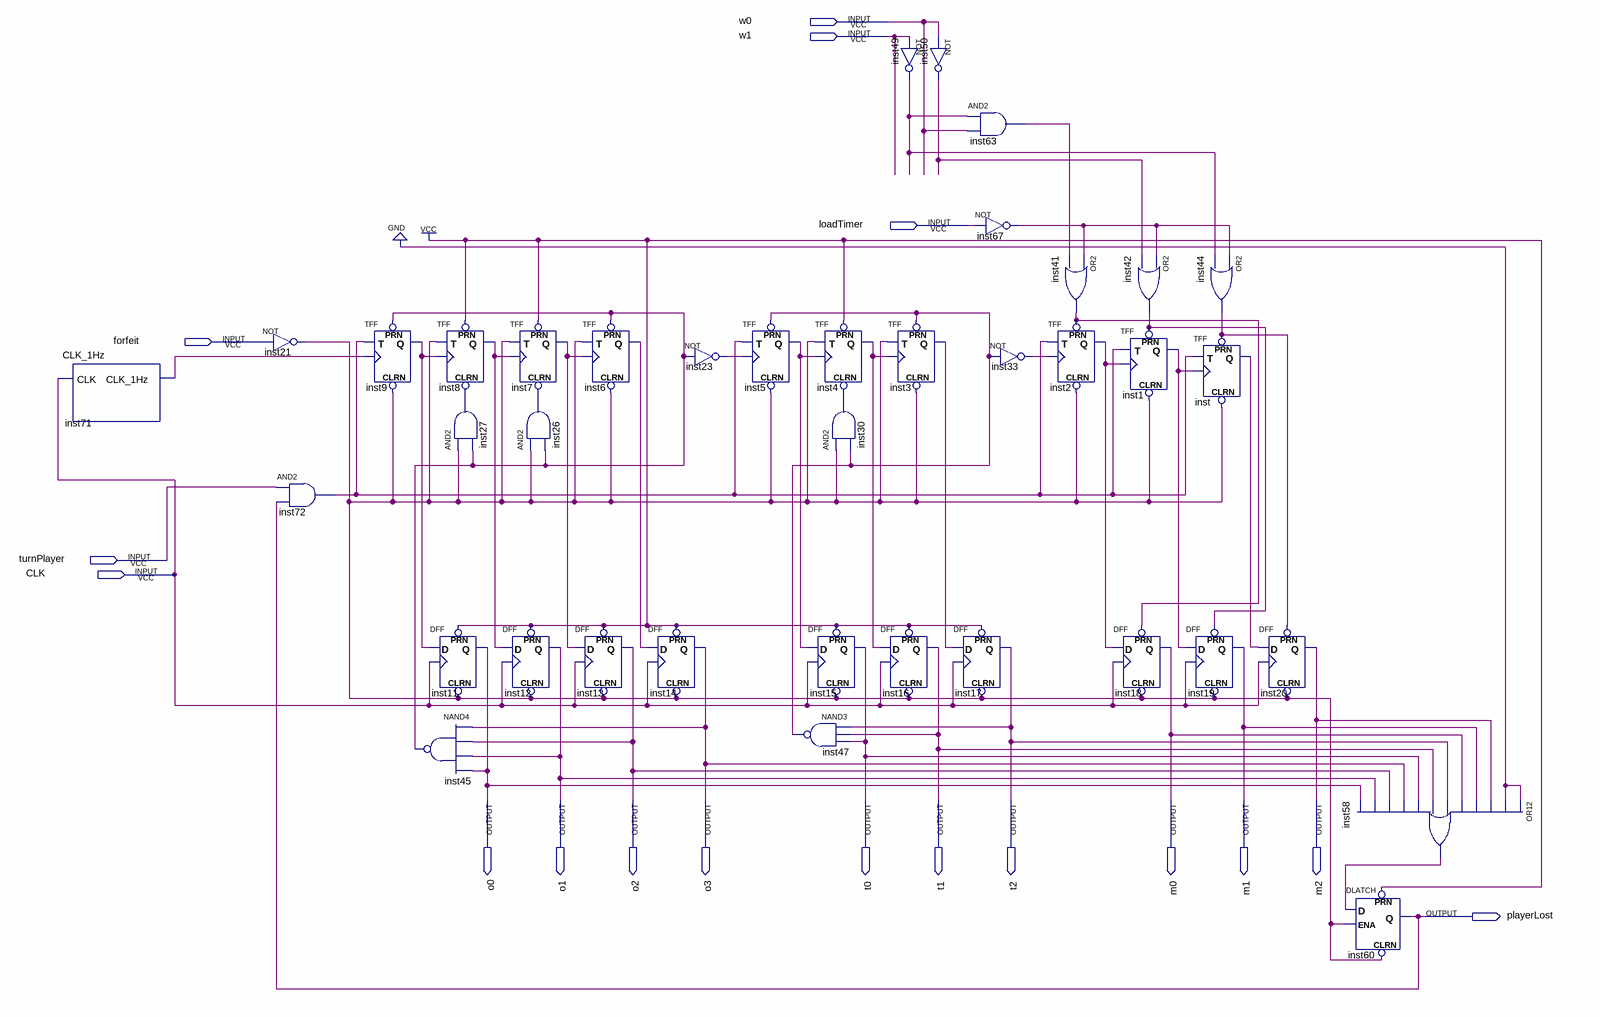
[diagram p0: schematic sheet]
// Quartus schematic player_register.bdf as structural Verilog: 39 symbols, 17 pins
module player_register (
  input  w0,
  input  w1,
  input  loadTimer,
  input  forfeit,
  input  turnPlayer,
  input  CLK,
  output o0,
  output o1,
  output o2,
  output o3,
  output t0,
  output t1,
  output t2,
  output m0,
  output m1,
  output m2,
  output playerLost
);

  wire inst1_q, inst2_q, inst3_q, inst4_q, inst5_q, inst6_q, inst7_q, inst8_q, inst9_q, inst21_out,
       inst23_out, inst26_out, inst27_out, inst30_out, inst33_out, inst41_out, inst42_out, inst44_out,
       inst45_out, inst47_out, inst49_out, inst50_out, inst58_out, inst63_out, inst67_out, inst71_clk_1hz,
       inst72_out, inst_q;

  CLK_1Hz inst71 (.CLK(CLK), .CLK_1Hz(inst71_clk_1hz));
  not inst21 (inst21_out, forfeit);
  and inst72 (inst72_out, turnPlayer, playerLost);
  TFF inst9 (.PRN(inst45_out), .CLRN(inst21_out), .T(inst72_out), .CLK(inst71_clk_1hz), .Q(inst9_q));
  nand inst45 (inst45_out, o3, o2, o1, o0);
  TFF inst8 (.PRN(1'b1), .CLRN(inst27_out), .T(inst21_out), .CLK(inst9_q), .Q(inst8_q));
  and inst27 (inst27_out, inst21_out, inst45_out);
  DFF inst11 (.CLRN(inst21_out), .CLK(CLK), .D(inst9_q), .PRN(1'b1), .Q(o0));
  TFF inst7 (.PRN(1'b1), .CLRN(inst26_out), .T(inst21_out), .CLK(inst8_q), .Q(inst7_q));
  and inst26 (inst26_out, inst21_out, inst45_out);
  DFF inst12 (.CLRN(inst21_out), .CLK(CLK), .D(inst8_q), .PRN(1'b1), .Q(o1));
  TFF inst6 (.PRN(inst45_out), .CLRN(inst21_out), .T(inst21_out), .CLK(inst7_q), .Q(inst6_q));
  DFF inst13 (.CLRN(inst21_out), .CLK(CLK), .D(inst7_q), .PRN(1'b1), .Q(o2));
  DFF inst14 (.CLRN(inst21_out), .CLK(CLK), .D(inst6_q), .PRN(1'b1), .Q(o3));
  not inst23 (inst23_out, inst45_out);
  TFF inst5 (.PRN(inst47_out), .CLRN(inst21_out), .T(inst72_out), .CLK(inst23_out), .Q(inst5_q));
  TFF inst4 (.PRN(1'b1), .CLRN(inst30_out), .T(inst21_out), .CLK(inst5_q), .Q(inst4_q));
  and inst30 (inst30_out, inst21_out, inst47_out);
  DFF inst15 (.CLRN(inst21_out), .CLK(CLK), .D(inst5_q), .PRN(1'b1), .Q(t0));
  nand inst47 (inst47_out, t2, t1, t0);
  TFF inst3 (.PRN(inst47_out), .CLRN(inst21_out), .T(inst21_out), .CLK(inst4_q), .Q(inst3_q));
  DFF inst16 (.CLRN(inst21_out), .CLK(CLK), .D(inst4_q), .PRN(1'b1), .Q(t1));
  not inst49 (inst49_out, w1);
  not inst50 (inst50_out, w0);
  and inst63 (inst63_out, inst49_out, w0);
  not inst67 (inst67_out, loadTimer);
  not inst33 (inst33_out, inst47_out);
  DFF inst17 (.CLRN(inst21_out), .CLK(CLK), .D(inst3_q), .PRN(1'b1), .Q(t2));
  or inst41 (inst41_out, inst67_out, inst63_out);
  TFF inst2 (.PRN(inst41_out), .CLRN(inst21_out), .T(inst72_out), .CLK(inst33_out), .Q(inst2_q));
  TFF inst1 (.PRN(inst42_out), .CLRN(inst21_out), .T(inst72_out), .CLK(inst2_q), .Q(inst1_q));
  DFF inst18 (.CLRN(inst21_out), .CLK(CLK), .D(inst2_q), .PRN(inst41_out), .Q(m0));
  or inst42 (inst42_out, inst67_out, inst50_out);
  or inst44 (inst44_out, inst67_out, inst49_out);
  TFF inst (.PRN(inst44_out), .CLRN(inst21_out), .T(inst72_out), .CLK(inst1_q), .Q(inst_q));
  DFF inst19 (.CLRN(inst21_out), .CLK(CLK), .D(inst1_q), .PRN(inst42_out), .Q(m1));
  DFF inst20 (.CLRN(inst21_out), .CLK(CLK), .D(inst_q), .PRN(inst44_out), .Q(m2));
  or inst58 (inst58_out, 1'b0, 1'b0, m2, m1, m0, t2, t1, t0, o3, o2, o1, o0);
  DLATCH inst60 (.CLRN(inst21_out), .D(inst58_out), .ENA(inst21_out), .PRN(1'b1), .Q(playerLost));
endmodule
